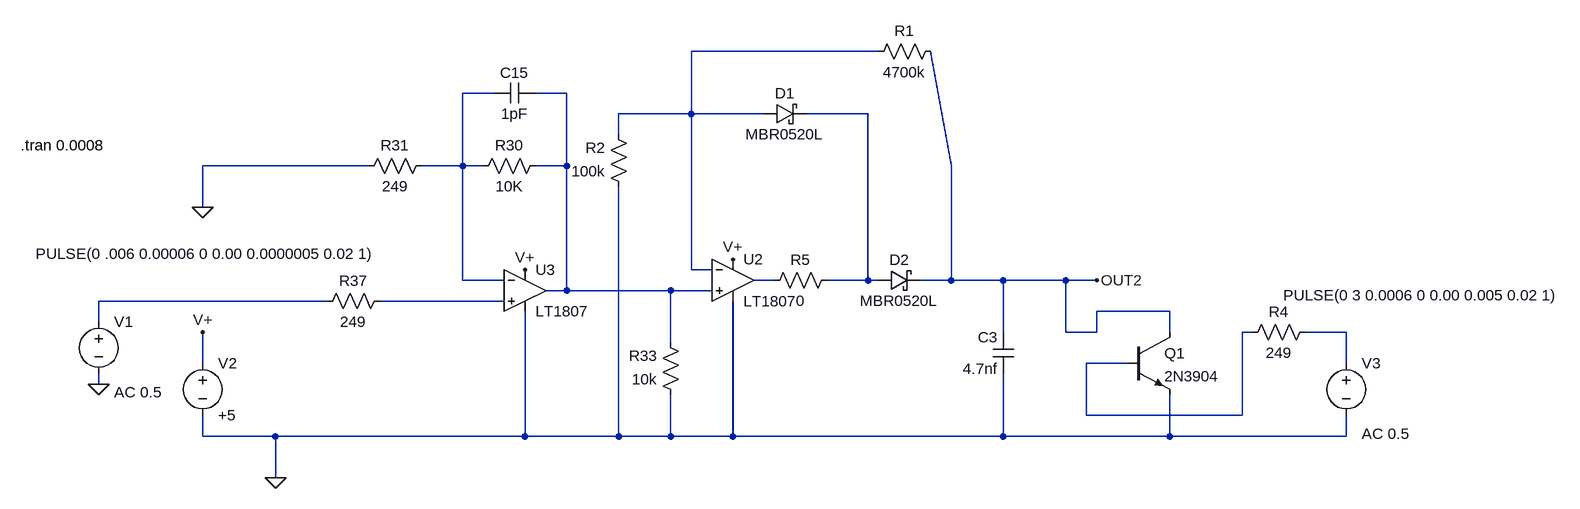
[diagram p0: schematic Muons_moyenne_01.asc]
Muons_moyenne_01.asc, the LTspice schematic file:
Version 4
SHEET 1 5945676 13421556
WIRE 1216 -432 928 -432
WIRE 624 -368 576 -368
WIRE 736 -368 688 -368
WIRE 928 -336 928 -432
WIRE 928 -336 816 -336
WIRE 1040 -336 928 -336
WIRE 1200 -336 1104 -336
WIRE 816 -304 816 -336
WIRE 432 -256 176 -256
WIRE 576 -256 576 -368
WIRE 576 -256 512 -256
WIRE 608 -256 576 -256
WIRE 736 -256 736 -368
WIRE 736 -256 688 -256
WIRE 1328 -256 1296 -432
WIRE 176 -192 176 -256
WIRE 928 -96 928 -336
WIRE 960 -96 928 -96
WIRE 576 -80 576 -256
WIRE 640 -80 576 -80
WIRE 1056 -80 1024 -80
WIRE 1200 -80 1200 -336
WIRE 1200 -80 1136 -80
WIRE 1216 -80 1200 -80
WIRE 1328 -80 1328 -256
WIRE 1328 -80 1280 -80
WIRE 1408 -80 1328 -80
WIRE 1504 -80 1408 -80
WIRE 1552 -80 1504 -80
WIRE 736 -64 736 -256
WIRE 736 -64 704 -64
WIRE 896 -64 736 -64
WIRE 960 -64 896 -64
WIRE 368 -48 16 -48
WIRE 640 -48 448 -48
WIRE 1664 -32 1552 -32
WIRE 16 -16 16 -48
WIRE 1408 0 1408 -80
WIRE 1504 0 1504 -80
WIRE 1552 0 1552 -32
WIRE 1552 0 1504 0
WIRE 1664 0 1664 -32
WIRE 1792 0 1776 0
WIRE 1936 0 1872 0
WIRE 896 16 896 -64
WIRE 176 48 176 0
WIRE 1600 48 1536 48
WIRE 1936 48 1936 0
WIRE 16 80 16 64
WIRE 1536 128 1536 48
WIRE 1776 128 1776 0
WIRE 1776 128 1536 128
WIRE 176 160 176 128
WIRE 288 160 176 160
WIRE 672 160 672 -32
WIRE 672 160 288 160
WIRE 816 160 816 -224
WIRE 816 160 672 160
WIRE 896 160 896 96
WIRE 896 160 816 160
WIRE 992 160 992 -48
WIRE 992 160 896 160
WIRE 1408 160 1408 64
WIRE 1408 160 992 160
WIRE 1664 160 1664 96
WIRE 1664 160 1408 160
WIRE 1936 160 1936 128
WIRE 1936 160 1664 160
WIRE 288 224 288 160
FLAG 16 80 0
FLAG 288 224 0
FLAG 672 -96 V+
FLAG 176 0 V+
FLAG 176 -192 0
FLAG 1552 -80 OUT2
FLAG 992 -112 V+
SYMBOL voltage 16 -32 R0
WINDOW 123 24 124 Left 2
WINDOW 39 0 0 Left 0
WINDOW 3 -97 -89 Left 2
SYMATTR Value2 AC 0.5
SYMATTR Value PULSE(0 .006 0.00006 0 0.00 0.0000005 0.02 1)
SYMATTR InstName V1
SYMBOL res 704 -272 R90
WINDOW 0 0 56 VBottom 2
WINDOW 3 32 56 VTop 2
SYMATTR InstName R30
SYMATTR Value 10K
SYMBOL res 464 -64 R90
WINDOW 0 0 56 VBottom 2
WINDOW 3 32 56 VTop 2
SYMATTR InstName R37
SYMATTR Value 249
SYMBOL res 528 -272 R90
WINDOW 0 0 56 VBottom 2
WINDOW 3 32 56 VTop 2
SYMATTR InstName R31
SYMATTR Value 249
SYMBOL cap 688 -384 R90
WINDOW 0 0 32 VBottom 2
WINDOW 3 32 32 VTop 2
SYMATTR InstName C15
SYMATTR Value 1pF
SYMBOL voltage 176 32 R0
WINDOW 123 0 0 Left 0
WINDOW 39 0 0 Left 0
SYMATTR InstName V2
SYMATTR Value +5
SYMBOL res 912 112 R180
WINDOW 0 36 76 Left 2
WINDOW 3 36 40 Left 2
SYMATTR InstName R33
SYMATTR Value 10k
SYMBOL cap 1424 64 R180
WINDOW 0 24 56 Left 2
WINDOW 3 24 8 Left 2
SYMATTR InstName C3
SYMATTR Value 4.7nf
SYMBOL OpAmps\\LT1807 992 -144 R0
SYMATTR InstName U2
SYMBOL OpAmps\\LT1807 672 -128 R0
SYMATTR InstName U3
SYMBOL schottky 1216 -64 R270
WINDOW 0 32 32 VTop 2
WINDOW 3 0 32 VBottom 2
SYMATTR InstName D2
SYMATTR Value MBR0520L
SYMATTR Description Diode
SYMATTR Type diode
SYMBOL res 1312 -448 R90
WINDOW 0 0 56 VBottom 2
WINDOW 3 32 56 VTop 2
SYMATTR InstName R1
SYMATTR Value 4700k
SYMBOL voltage 1936 32 R0
WINDOW 123 24 124 Left 2
WINDOW 39 0 0 Left 0
WINDOW 3 -97 -89 Left 2
SYMATTR Value2 AC 0.5
SYMATTR Value PULSE(0 3 0.0006 0 0.00 0.005 0.02 1)
SYMATTR InstName V3
SYMBOL res 1888 -16 R90
WINDOW 0 0 56 VBottom 2
WINDOW 3 32 56 VTop 2
SYMATTR InstName R4
SYMATTR Value 249
SYMBOL npn 1600 0 R0
SYMATTR InstName Q1
SYMATTR Value 2N3904
SYMBOL res 1152 -96 R90
WINDOW 0 0 56 VBottom 2
WINDOW 3 32 56 VTop 2
SYMATTR InstName R5
SYMATTR Value 0
SYMBOL res 832 -208 R180
WINDOW 0 36 76 Left 2
WINDOW 3 36 40 Left 2
SYMATTR InstName R2
SYMATTR Value 100k
SYMBOL schottky 1040 -320 R270
WINDOW 0 32 32 VTop 2
WINDOW 3 0 32 VBottom 2
SYMATTR InstName D1
SYMATTR Value MBR0520L
SYMATTR Description Diode
SYMATTR Type diode
TEXT -104 -288 Left 2 !.tran 0.0008

The netlist it stands for:
* Muons_moyenne_01.asc
V1 N006 0 PULSE(0 .006 0.00006 0 0.00 0.0000005 0.02 1) AC 0.5
R30 N003 N002 10K
R37 N007 N006 249
R31 N002 0 249
C15 N003 N002 1pF
V2 V+ 0 +5
R33 0 N003 10k
C3 0 OUT2 4.7nf
XU2 N003 N001 V+ 0 N005 LT1807  ; pins In+ In- V+ V- OUT
XU3 N007 N002 V+ 0 N003 LT1807  ; pins In+ In- V+ V- OUT
D2 N004 OUT2 MBR0520L
R1 OUT2 N001 4700k
V3 N009 0 PULSE(0 3 0.0006 0 0.00 0.005 0.02 1) AC 0.5
R4 N009 N008 249
Q1 OUT2 N008 0 0 2N3904
R5 N004 N005 0
R2 0 N001 100k
D1 N001 N004 MBR0520L
.model D D
.lib standard.dio
.model NPN NPN
.model PNP PNP
.lib standard.bjt
.tran 0.0008
.backanno
.end